# EAGLE schematic PARKWISE NODE RAK3172-Breakout (EAGLE 9.6.2)
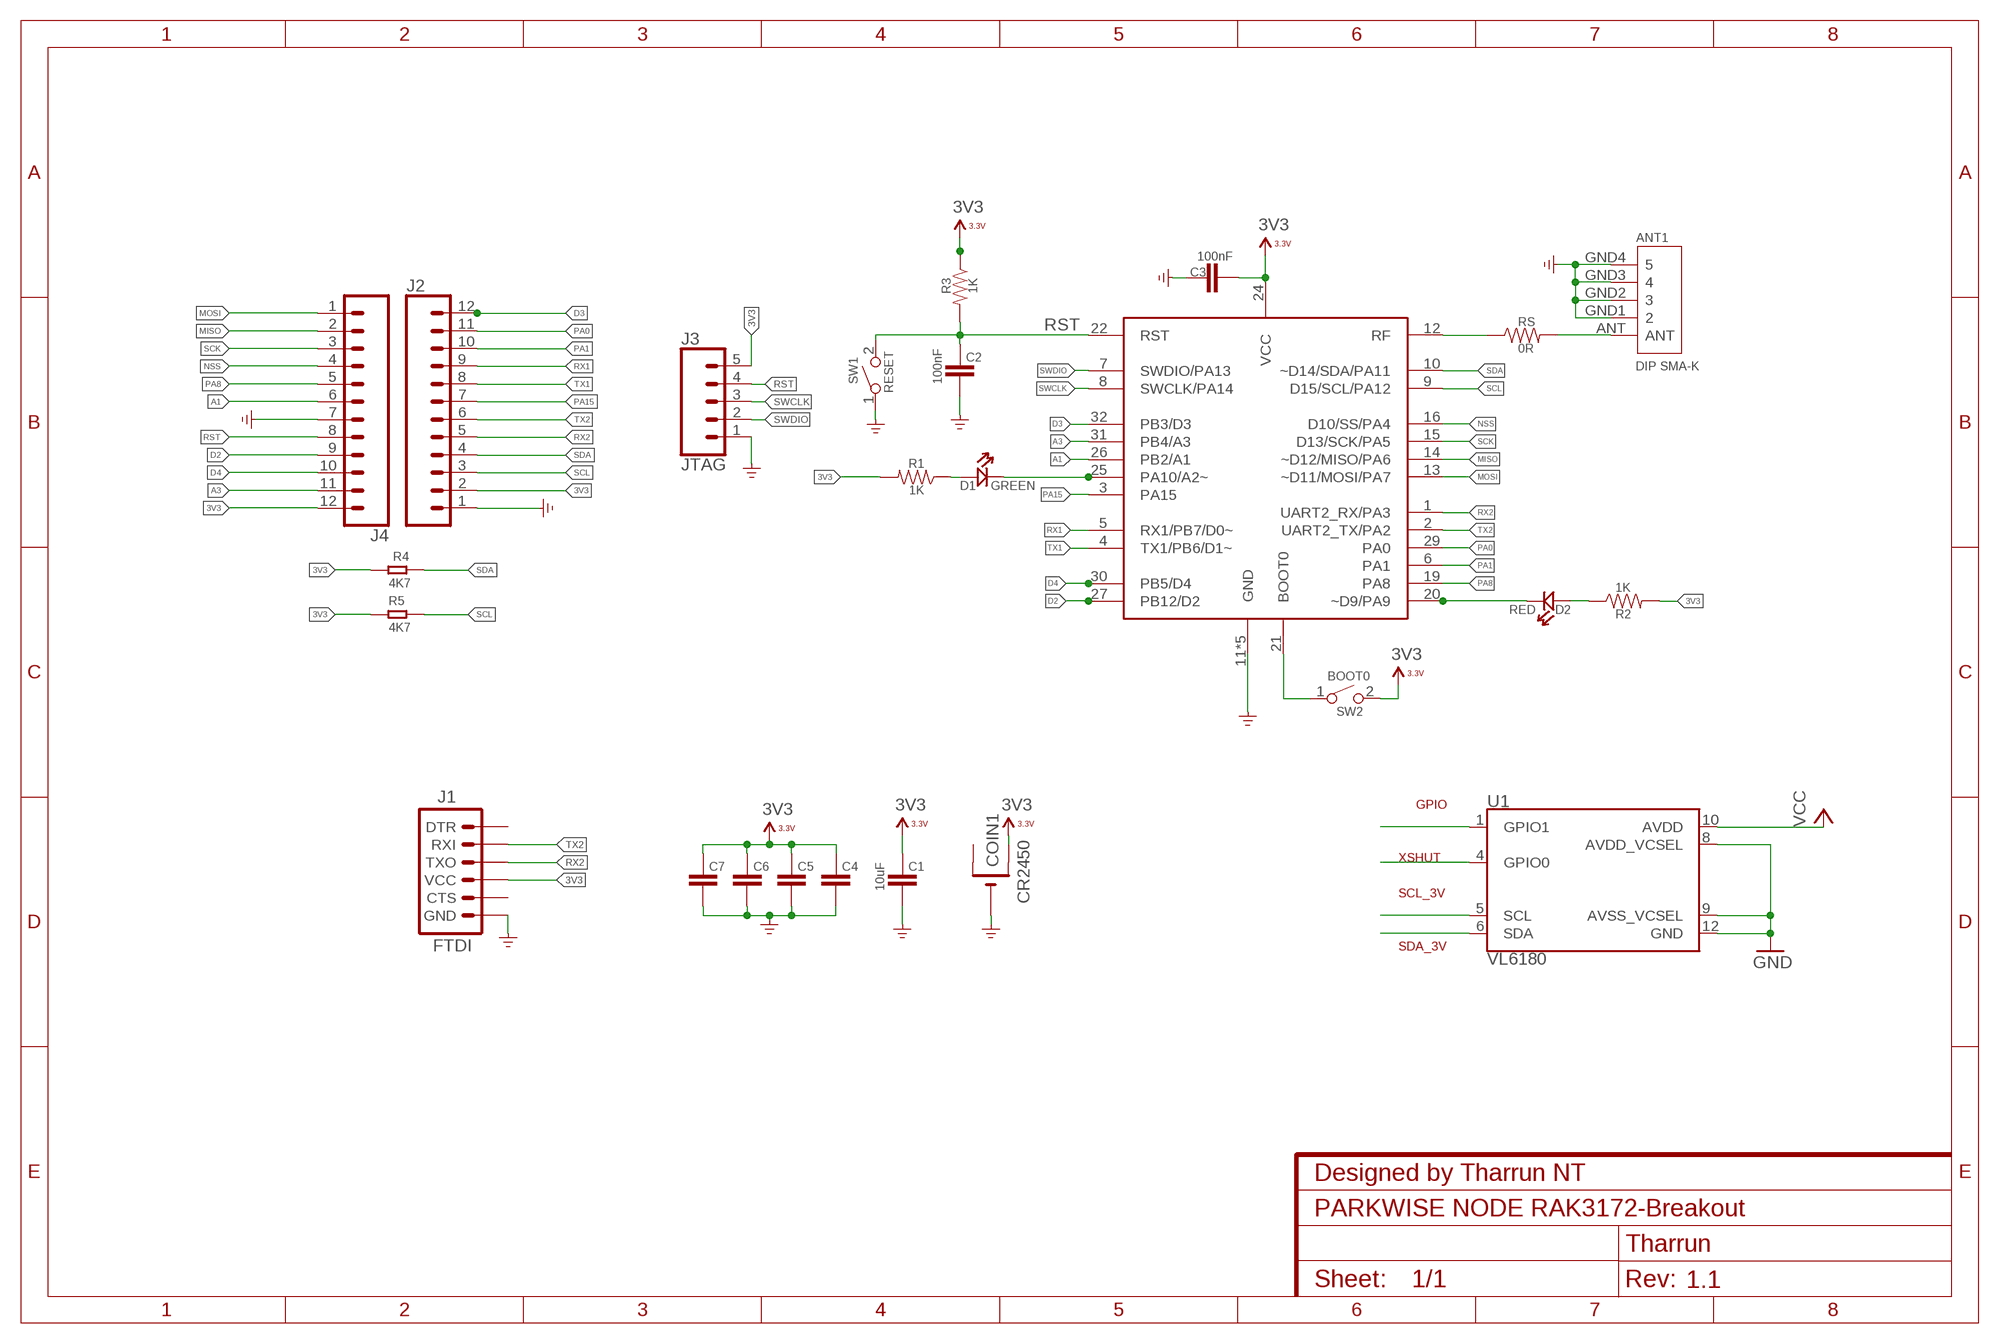
[diagram p0: schematic, sheet 1]
NAME (FRAME-A4L): CNAME: Designed by Tharrun NT; CREVISION: 1.1; DESIGNER: Tharrun

## Parts
ANT1  DIP SMA-K  ANTENNA-SMA-MCX-JE-320160125  [SMA5P-SMD-5.1-6.5X6.5X16.5MM]
C1  10uF  CAP0805-CAP  [0805-CAP]
C2  100nF  CAP0805-CAP  [0805-CAP]
C3  100nF  CAP0805-CAP  [0805-CAP]
C4  100uF  CAP0805-CAP  [0805-CAP]
C5  100uF  CAP0805-CAP  [0805-CAP]
C6  100uF  CAP0805-CAP  [0805-CAP]
C7  100uF  CAP0805-CAP  [0805-CAP]
COIN1  CR2450  CR2450SMD  [CR2450-SMD]
D1  GREEN  LED'0805'  [LED-0805]
D2  RED  LED'0805'  [LED-0805]
J1  FTDI  6_PIN_SERIAL_TARGETSMD  [1X06-SMD_RA_MALE]
J2  CONN_12NO_SILK  [1X12_NO_SILK]
J3  JTAG  CONN_05LOCK  [1X05_LOCK]
J4  CONN_12NO_SILK  [1X12_NO_SILK]
R1  1K  RESISTOR0805-RES  [0805-RES]
R2  1K  RESISTOR0805-RES  [0805-RES]
R3  1K  RESISTOR0805-RES  [0805-RES]
R4  4K7  RES-0805  [R0805]
R5  4K7  RES-0805  [R0805]
RS  0R  RESISTORMATCHINGNETWORK  [0603-MATCHNET]
SW1  RESET  SMD-BUTTON(2P-3.0X2.5X1.2+0.4MM)-B3U-1000P-2P-SMD  [SW2-2.6-3.0X2.5X1.2+0.4MM]
SW2  BOOT0  SMD-BUTTON(2P-3.0X2.5X1.2+0.4MM)-B3U-1000P-2P-SMD  [SW2-2.6-3.0X2.5X1.2+0.4MM]
U1  VL6180  [VL6180]
U$3  RAK3172HF  [RAK3172]

## Nets
3V3: C1.2 C3.2 C4.2 C5.2 C6.2 C7.2 COIN1.+$2(+1) J1.4(VCC) J2.2 J3.5 J4.12 R1.2 R2.2 R3.1 R4.1 R5.1 SW2.2 U$3.24(VCC)
A1: J4.6 U$3.26(PB2/A1)
A3: J4.11 U$3.31(PB4/A3)
D2: J4.9 U$3.27(PB12/D2)
D3: J2.12 U$3.32(PB3/D3)
D4: J4.10 U$3.30(PB5/D4)
GND: ANT1.GND1 ANT1.GND2 ANT1.GND3 ANT1.GND4 C1.1 C2.1 C3.1 C4.1 C5.1 C6.1 C7.1 COIN1.- J1.6(GND) J2.1 J3.1 J4.7 SW1.1 U1.8(AVDD_VCSEL) U1.9(AVSS_VCSEL) U1.12(GND) U$3.11(GND) U$3.17(GND) U$3.18(GND) U$3.23(GND) U$3.28(GND) ; supply symbol labelled GND_POWER
GREEN: D1.- U$3.25(PA10/A2~)
MISO: J4.2 U$3.14(~D12/MISO/PA6)
MOSI: J4.1 U$3.13(~D11/MOSI/PA7)
N$1: U1.6(SDA)
N$2: D1.+ R1.1
N$3: SW2.1 U$3.21(BOOT0)
N$4: U1.5(SCL)
N$5: U1.4(GPIO0)
N$6: U1.1(GPIO1)
N$12: D2.+ R2.1
N$13: ANT1.ANT RS.2
NSS: J4.4 U$3.16(D10/SS/PA4)
PA0: J2.11 U$3.29(PA0)
PA1: J2.10 U$3.6(PA1)
PA8: J4.5 U$3.19(PA8)
PA15: J2.7 U$3.3(PA15)
RED: D2.- U$3.20(~D9/PA9)
RF: RS.1 U$3.12(RF)
RST: C2.2 J3.4 J4.8 R3.2 SW1.2 U$3.22(RST)
RX1: J2.9 U$3.5(RX1/PB7/D0~)
RX2: J1.3(TXO) J2.5 U$3.1(UART2_RX/PA3)
SCK: J4.3 U$3.15(D13/SCK/PA5)
SCL: J2.3 R5.2 U$3.9(D15/SCL/PA12)
SDA: J2.4 R4.2 U$3.10(~D14/SDA/PA11)
SWCLK: J3.3 U$3.8(SWCLK/PA14)
SWDIO: J3.2 U$3.7(SWDIO/PA13)
TX1: J2.8 U$3.4(TX1/PB6/D1~)
TX2: J1.2(RXI) J2.6 U$3.2(UART2_TX/PA2)
VCC: U1.10(AVDD)
Unconnected: COIN1.+$1(+) J1.1(DTR) J1.5(CTS)

## Notes on the sheet
- GPIO
- XSHUT
- SCL_3V
- SDA_3V

## Library data of the parts
ANT1 = Connector-new:ANTENNA-SMA-MCX-JE
C1-C7 = _c2h:CAP: Capacitor Standard 0603 ceramic capacitor, and 0.1" leaded capacitor.
COIN1 = _c2h:CR2450
D1 D2 = Discrete-new:LED
J1 = SparkFun-Connectors:6_PIN_SERIAL_TARGET: 6-pin header connection for use with the "FTDI BASIC" pinout - TARGET SIDE. Also known as "Arduino Serial Program Header". It is used to mate with our FTDI Basic serial programmers using the Arduino IDE. Note, this device has "TARGET" in the name. It is intended to be used on a design that contains a target micro-controller that you wish to program. The "sister" device, named "CABLE" is inteneded to be used on a design that usually lives on the end of your USB cable and prvides the converter chip (FTDI232 or FTDI231x) to commnicate serial RX/TX. You can populate with some of these: Break Away Headers - Straight <https://www.sparkfun.com/products/116> (PRT-00116) For reference (or to suit your programming needs) check out these designs: SparkFun FTDI Basic Breakout - 5V <https://www.sparkfun.com/products/9716> (DEV-09716) SparkFun FTDI Basic Breakout - 3.3V <https://www.sparkfun.com/products/9873> (DEV-09873) SparkFun FTDI SmartBasic <https://www.sparkfun.com/products/12935> (DEV-12935) SparkFun Beefy 3 - FTDI Basic Breakout <https://www.sparkfun.com/products/13746> (DEV-13746); PROD_ID: CONN-08971
J2 J4 = SparkFun-Connectors:CONN_12: Multi connection point. Often used as Generic Header-pin footprint for 0.1 inch spaced/style header connections On any of the 0.1 inch spaced packages, you can populate with these: Break Away Headers - Straight <https://www.sparkfun.com/products/116> (PRT-00116) Break Away Male Headers - Right Angle <https://www.sparkfun.com/products/553> (PRT-00553) Female Headers <https://www.sparkfun.com/products/115> (PRT-00115) Break Away Headers - Machine Pin <https://www.sparkfun.com/products/117> (PRT-00117) Break Away Female Headers - Swiss Machine Pin <https://www.sparkfun.com/products/743> (PRT-00743) For SCREWTERMINALS and SPRING TERMINALS visit here: Screw Terimnals on SparkFun.com <https://www.sparkfun.com/search/results?term=Screw+Terminals> (5mm/3.5mm/2.54mm spacing) This device is also useful as a general connection point to wire up your design to another part of your project. Our various solder wires solder well into these plated through hole pads. Hook-Up Wire - Assortment (Stranded, 22 AWG) <https://www.sparkfun.com/products/11375> (PRT-11375) Hook-Up Wire - Assortment (Solid Core, 22 AWG) <https://www.sparkfun.com/products/11367> (PRT-11367) View the entire wire category on our website here <https://www.sparkfun.com/categories/141> Special notes: Molex polarized connector foot print use with SKU : PRT-08231 with associated crimp pins and housings. 1MM SMD Version SKU: PRT-10208 NOTES ON THE VARIANTS LOCK and LOCK_LONGPADS... This footprint was designed to help hold the alignment of a through-hole component (i.e. 6-pin header) while soldering it into place. You may notice that each hole has been shifted either up or down by 0.005 of an inch from it's more standard position (which is a perfectly straight line). This slight alteration caused the pins (the squares in the middle) to touch the edges of the holes. Because they are alternating, it causes a "brace" to hold the component in place. 0.005 has proven to be the perfect amount of "off-center" position when using our standard breakaway headers. Although looks a little odd when you look at the bare footprint, once you have a header in there, the alteration is very hard to notice. Also,if you push a header all the way into place, it is covered up entirely on the bottom side.
J3 = SparkFun-Connectors:CONN_05: Multi connection point. Often used as Generic Header-pin footprint for 0.1 inch spaced/style header connections On any of the 0.1 inch spaced packages, you can populate with these: Break Away Headers - Straight <https://www.sparkfun.com/products/116> (PRT-00116) Break Away Male Headers - Right Angle <https://www.sparkfun.com/products/553> (PRT-00553) Female Headers <https://www.sparkfun.com/products/115> (PRT-00115) Break Away Headers - Machine Pin <https://www.sparkfun.com/products/117> (PRT-00117) Break Away Female Headers - Swiss Machine Pin <https://www.sparkfun.com/products/743> (PRT-00743) For SCREWTERMINALS and SPRING TERMINALS visit here: Screw Terimnals on SparkFun.com <https://www.sparkfun.com/search/results?term=Screw+Terminals> (5mm/3.5mm/2.54mm spacing) This device is also useful as a general connection point to wire up your design to another part of your project. Our various solder wires solder well into these plated through hole pads. Hook-Up Wire - Assortment (Stranded, 22 AWG) <https://www.sparkfun.com/products/11375> (PRT-11375) Hook-Up Wire - Assortment (Solid Core, 22 AWG) <https://www.sparkfun.com/products/11367> (PRT-11367) View the entire wire category on our website here <https://www.sparkfun.com/categories/141> Special notes: Molex polarized connector foot print use with SKU : PRT-08231 with associated crimp pins and housings. 1MM SMD Version SKU: PRT-10208
R1-R3 RS = _c2h:RESISTOR: Resistor Basic schematic elements and footprints for 0603, 1206, and PTH resistors.
R4 R5 = Discrete-new:RES
SW1 SW2 = _c2h:SMD-BUTTON(2P-3.0X2.5X1.2+0.4MM): 311020047; MPN: B3U-1000P-2P-SMD; VALUE: B3U-1000P-2P-SMD
U1 = SparkFun-Sensors:VL6180: ST VL6180X Proximity and Ambient Light Sensing (ALS) Module Instead of estimating the distance by measuring the amount of light reflected back from the object (which is significantly influenced by color and surface), the VL6180 precisely measures the time the light takes to travel to the nearest object and reflect back to the sensor (Time-of-Flight). Combining an IR emitter, a range sensor and an ambient light sensor in a three-in-one ready-to-use reflowable package, the VL6180 is easy to integrate and saves the end-product makers the long and costly optical and mechanical design optimizations. Datasheet <https://cdn.sparkfun.com/datasheets/Sensors/Proximity/DM00112632.pdf> SparkFun Products SparkFun ToF Range Finder Breakout - VL6180 <https://www.sparkfun.com/products/12784> (SEN-12784) SparkFun ToF Range Finder Sensor - VL6180 <https://www.sparkfun.com/products/12785> (SEN-12785); PROD_ID: IC-12007
U$3 = RAK3172:RAK3172: RAK4260 LoRaWAN module from RAKwireless.

## Module ULTRASONICSENSOR
Ports: 

### Library data of the parts